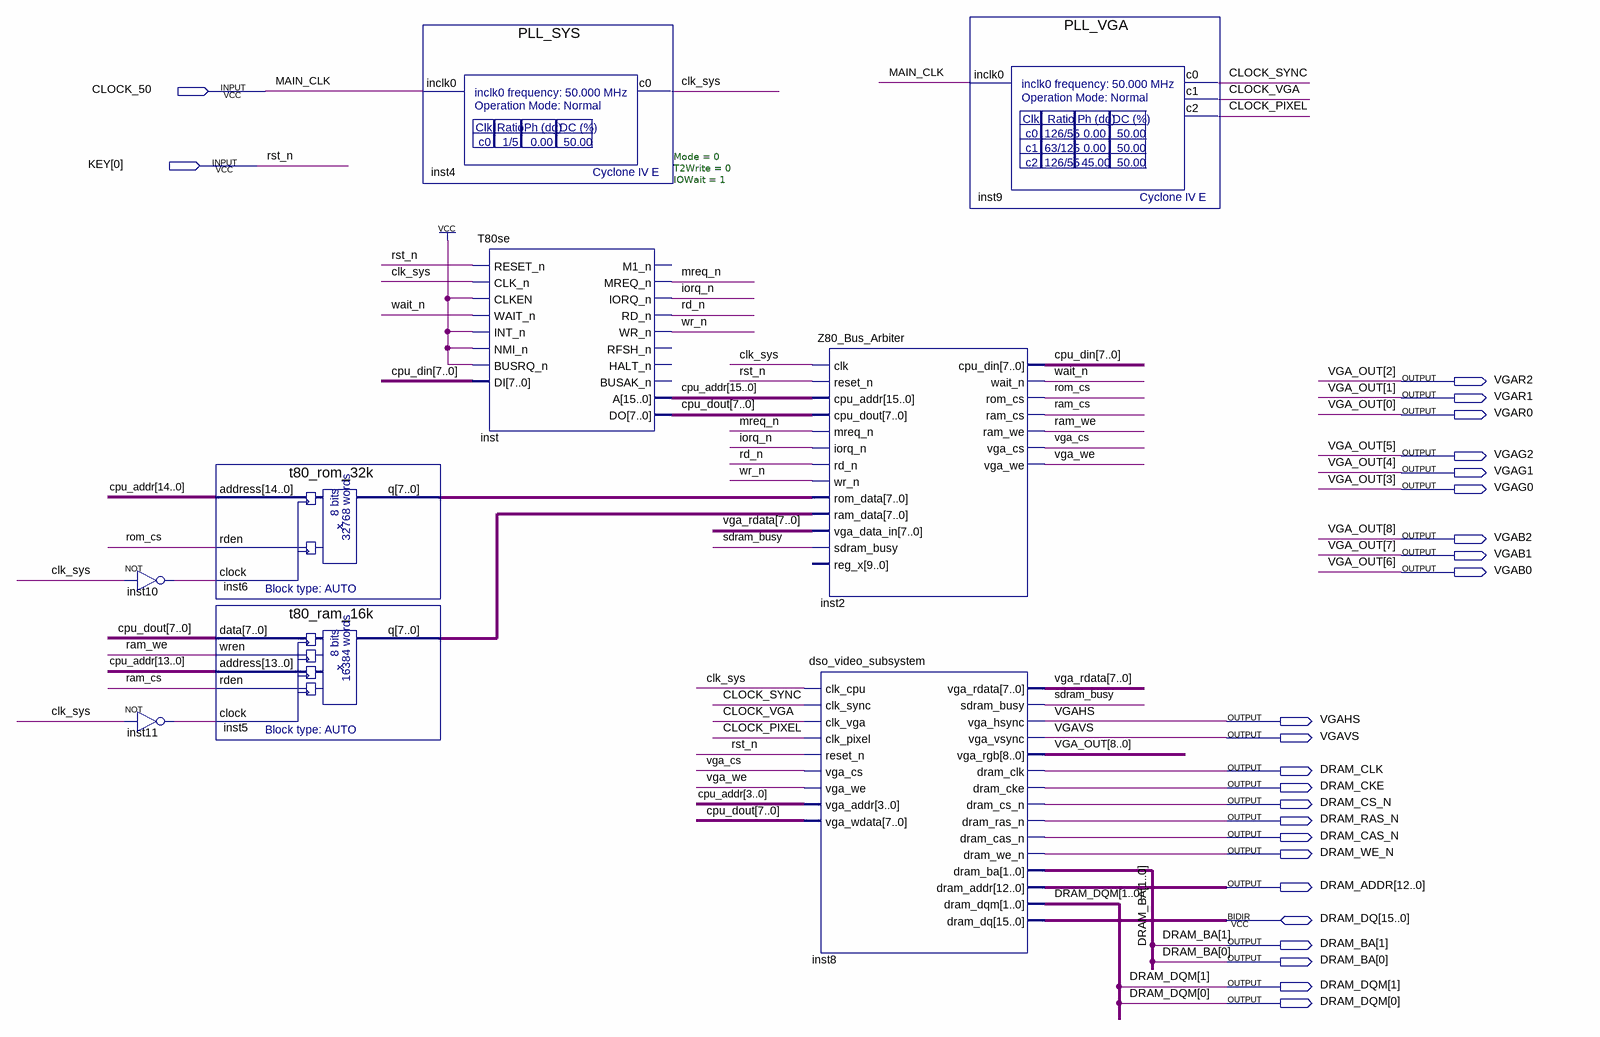
[diagram p0: schematic sheet]
// Quartus schematic T80_core.bdf as structural Verilog: 9 symbols, 25 pins
module T80_core (
  input  CLOCK_50,
  input  [0:0] KEY,
  inout  [15:0] DRAM_DQ,
  output VGAR2,
  output VGAR1,
  output VGAR0,
  output VGAG2,
  output VGAG1,
  output VGAG0,
  output VGAB2,
  output VGAB1,
  output VGAB0,
  output VGAHS,
  output VGAVS,
  output DRAM_CLK,
  output DRAM_CKE,
  output DRAM_CS_N,
  output DRAM_RAS_N,
  output DRAM_CAS_N,
  output DRAM_WE_N,
  output [12:0] DRAM_ADDR,
  output [1:0] DRAM_BA,
  output [1:0] DRAM_DQM
);

  wire clk_sys, CLOCK_PIXEL, CLOCK_SYNC, CLOCK_VGA, inst10_out, inst11_out, iorq_n, mreq_n, ram_cs, ram_we,
       rd_n, rom_cs, sdram_busy, vga_cs, vga_we, wait_n, wr_n;
  wire [7:0] cpu_din, cpu_dout, inst5_q, inst6_q, vga_rdata;
  wire [15:0] cpu_addr;

  not inst10 (inst10_out, clk_sys);
  not inst11 (inst11_out, clk_sys);
  t80_rom_32k inst6 (.address(cpu_addr[14:0]), .rden(rom_cs), .clock(inst10_out), .q(inst6_q));
  t80_ram_16k inst5 (
    .data(cpu_dout), .wren(ram_we), .address(cpu_addr[13:0]), .rden(ram_cs), .clock(inst11_out), .q(inst5_q));
  PLL_SYS inst4 (.inclk0(CLOCK_50), .c0(clk_sys));
  T80se #(.Mode(0), .T2Write(0), .IOWait(1)) inst (
    .RESET_n(KEY[0]), .CLK_n(clk_sys), .CLKEN(1'b1), .WAIT_n(wait_n), .INT_n(1'b1), .NMI_n(1'b1),
    .BUSRQ_n(1'b1), .DI(cpu_din), .MREQ_n(mreq_n), .IORQ_n(iorq_n), .RD_n(rd_n), .WR_n(wr_n), .A(cpu_addr),
    .DO(cpu_dout));  // open: M1_n, RFSH_n, HALT_n, BUSAK_n
  Z80_Bus_Arbiter inst2 (
    .clk(clk_sys), .reset_n(KEY[0]), .cpu_addr(cpu_addr), .cpu_dout(cpu_dout), .mreq_n(mreq_n),
    .iorq_n(iorq_n), .rd_n(rd_n), .wr_n(wr_n), .rom_data(inst6_q), .ram_data(inst5_q),
    .vga_data_in(vga_rdata), .sdram_busy(sdram_busy), .cpu_din(cpu_din), .wait_n(wait_n), .rom_cs(rom_cs),
    .ram_cs(ram_cs), .ram_we(ram_we), .vga_cs(vga_cs), .vga_we(vga_we));  // open: reg_x
  dso_video_subsystem inst8 (
    .clk_cpu(clk_sys), .clk_sync(CLOCK_SYNC), .clk_vga(CLOCK_VGA), .clk_pixel(CLOCK_PIXEL), .reset_n(KEY[0]),
    .vga_cs(vga_cs), .vga_we(vga_we), .vga_addr(cpu_addr[3:0]), .vga_wdata(cpu_dout), .vga_rdata(vga_rdata),
    .sdram_busy(sdram_busy), .vga_hsync(VGAHS), .vga_vsync(VGAVS),
    .vga_rgb({VGAB2, VGAB1, VGAB0, VGAG2, VGAG1, VGAG0, VGAR2, VGAR1, VGAR0}), .dram_clk(DRAM_CLK),
    .dram_cke(DRAM_CKE), .dram_cs_n(DRAM_CS_N), .dram_ras_n(DRAM_RAS_N), .dram_cas_n(DRAM_CAS_N),
    .dram_we_n(DRAM_WE_N), .dram_ba(DRAM_BA), .dram_addr(DRAM_ADDR), .dram_dqm(DRAM_DQM), .dram_dq(DRAM_DQ));
  PLL_VGA inst9 (.inclk0(CLOCK_50), .c0(CLOCK_SYNC), .c1(CLOCK_VGA), .c2(CLOCK_PIXEL));

  // Other names for the same wires on the sheet: MAIN_CLK = CLOCK_50; rst_n = KEY[0];
  //   VGA_OUT[8:0] = {VGAB2, VGAB1, VGAB0, VGAG2, VGAG1, VGAG0, VGAR2, VGAR1, VGAR0}
endmodule
